# EAGLE design emonDCduo-ESP v2.4 (EAGLE 9.2.2)
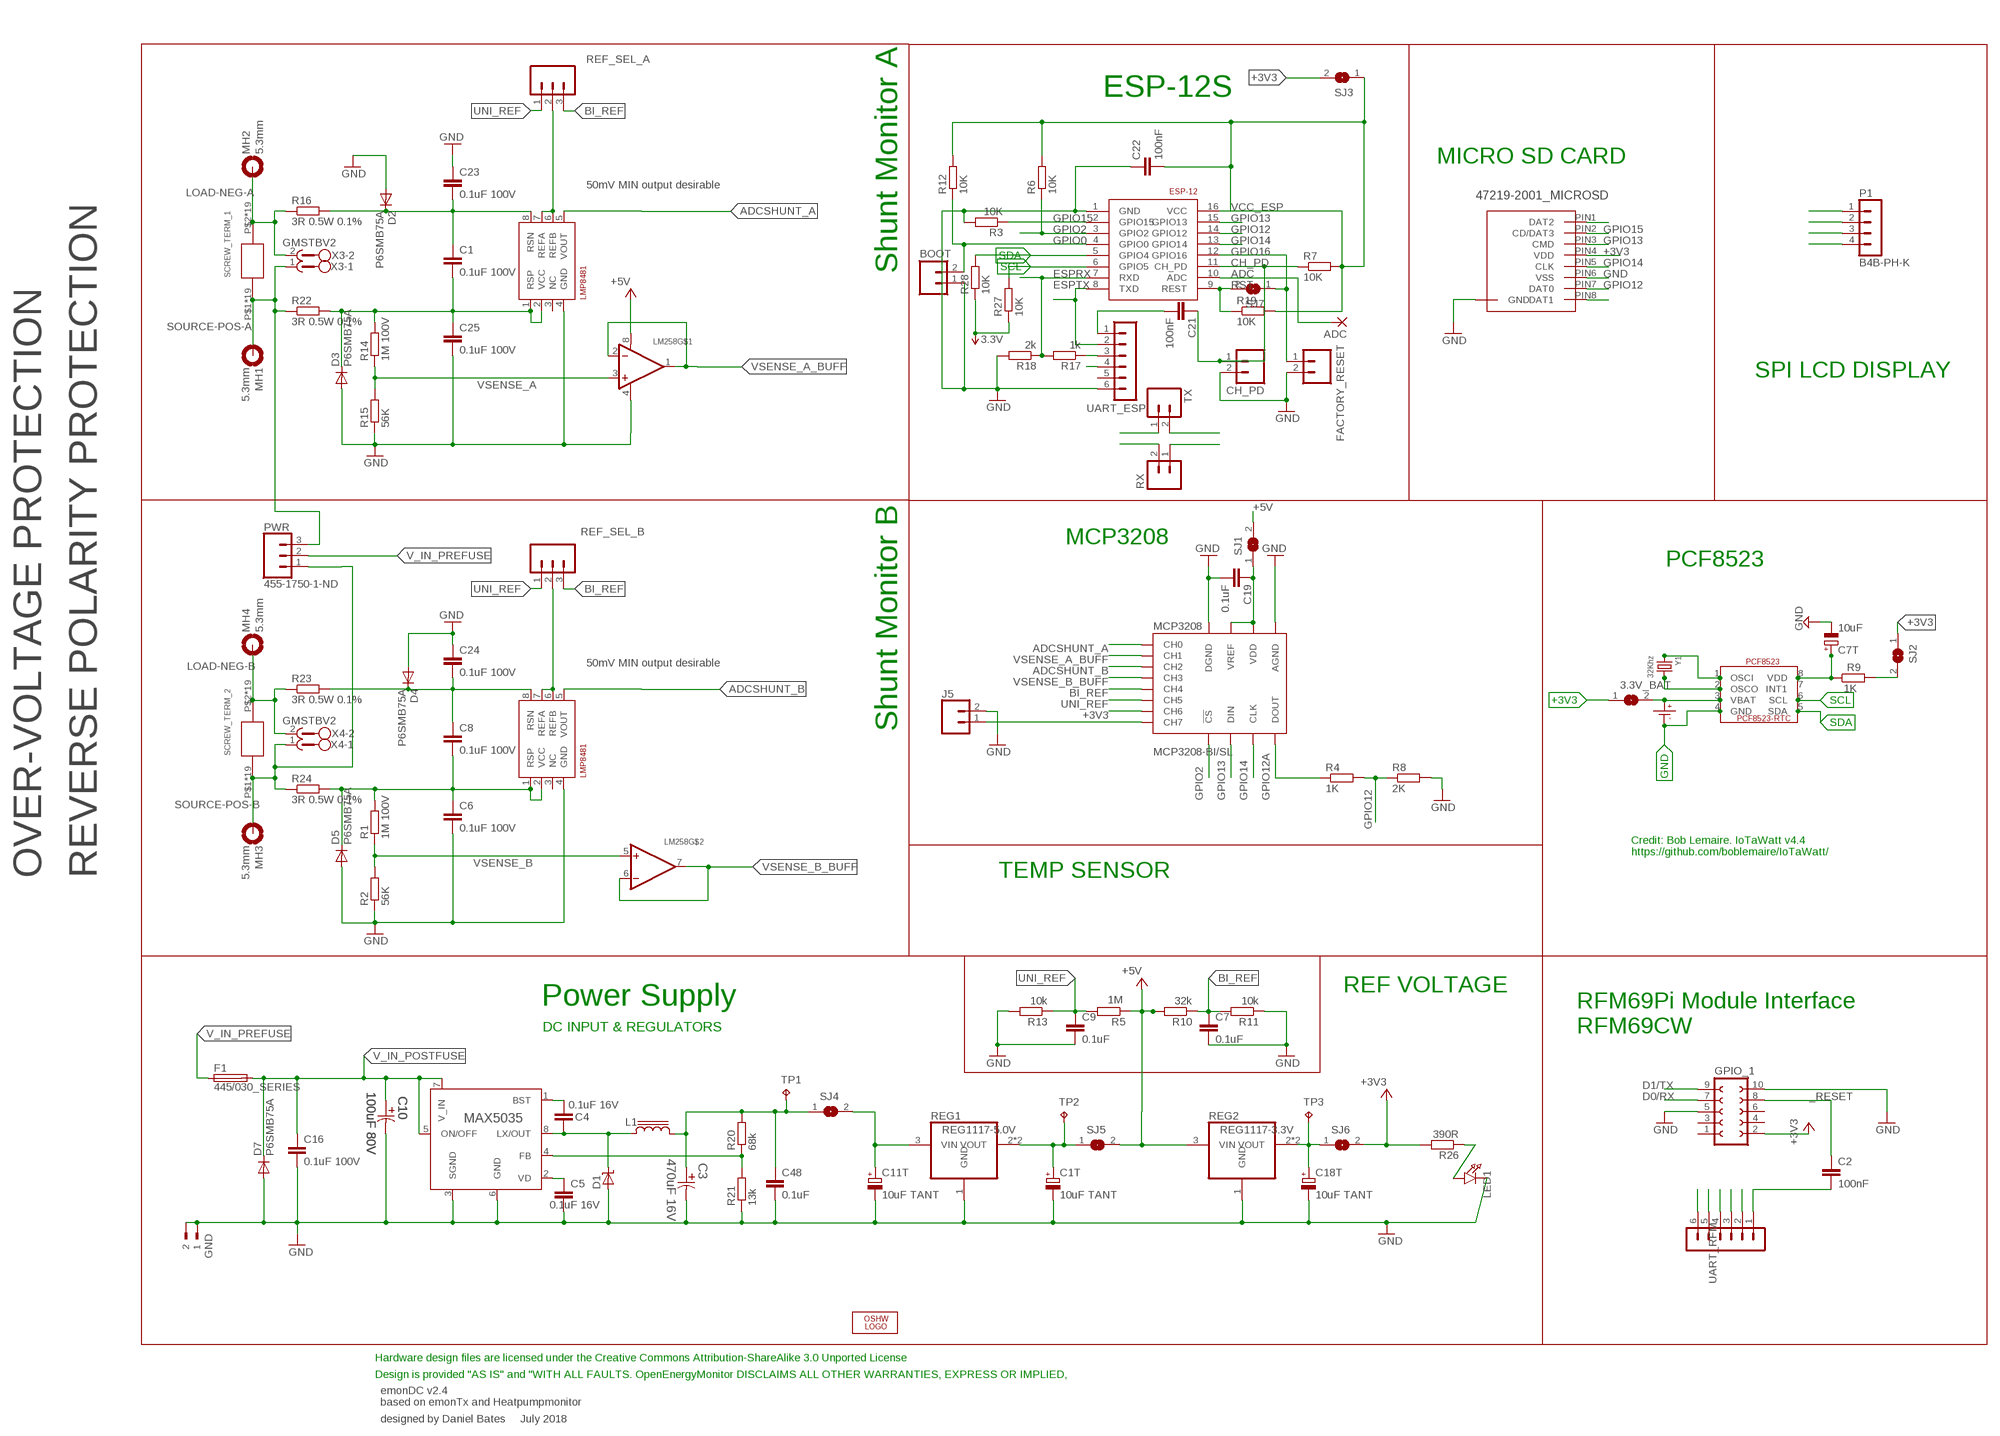
[diagram p0: schematic, sheet 1]

## Parts
3.3V_BAT  SJ-CONCON  [SJ-CON]
ADC  2,15/1,0  [2,15/1,0]
BOOT  M02PTH  [1X02]
C1  0.1uF 100V  C-EUC0603  [C0603]
C1T  10uF TANT  CPOL-EUC0603POL  [C0603POL]
C2  100nF  C-EUC0603  [C0603]
C3  470uF 16V  EEE-FK1C471P-CASE-F  [CAPAE830X1050N]
C4  0.1uF 16V  C-EUC0603  [C0603]
C5  0.1uF 16V  C-EUC0603  [C0603]
C6  0.1uF 100V  C-EUC0603  [C0603]
C7  0.1uF  C-EUC0603  [C0603]
C7T  10uF  CPOL-EUC0603POL  [C0603POL]
C8  0.1uF 100V  C-EUC0603  [C0603]
C9  0.1uF  C-EUC0603  [C0603]
C10  100uF 80V  EEV-FK1K101Q-CASE-H13  [CAPAE1350X1400N]
C11T  10uF TANT  CPOL-EUC0603POL  [C0603POL]
C16  0.1uF 100V  C-EUC0603  [C0603]
C18T  10uF TANT  CPOL-EUC0603POL  [C0603POL]
C19  0.1uF  C-EUC0603  [C0603]
C21  100nF  C-EUC0603  [C0603]
C22  100nF  C-EUC0603  [C0603]
C23  0.1uF 100V  C-EUC0603  [C0603]
C24  0.1uF 100V  C-EUC0603  [C0603]
C25  0.1uF 100V  C-EUC0603  [C0603]
C48  0.1uF  C-EUC0603  [C0603]
CH_PD  M02PTH  [1X02]
CR1220  CR1220SMD  [CR1220SMD]
D1  MBRS1100T3G  [SMB_1]
D2  P6SMB75A  DIODE-DO214AA  [DO214AA]
D3  P6SMB75A  DIODE-DO214AA  [DO214AA]
D4  P6SMB75A  DIODE-DO214AA  [DO214AA]
D5  P6SMB75A  DIODE-DO214AA  [DO214AA]
D7  P6SMB75A  DIODE-DO214AA  [DO214AA]
ESP-12  ESP8266_ESP-12  [ESP8266-ESP12]
F1  445/030_SERIES  [445/030_SERIES_LITTELFUSE]
GND  180-2  [180-2]
GPIO_1  FE05-2_RFM69PI_OUTLINERFM69PI  [FE05-2_RFM69PI_OULTINE]
IO16  FACTORY_RESET  M02PTH  [1X02]
J5  CONN_02  [1X02]
L1  SRR1208  [SSR1208]
LED1  LED1206  [CHIPLED_1206]
LM258  LM358  [SOIC8_150MIL]
LOGO1  OSHW_LOGO_6MILX0200-NT  [OSHW_6X200_NOTEXT]
MCP3208  MCP3208-BI/SL  [SOIC16]
MH1  5.3mm  MOUNT-PAD-ROUND5.3  [5,3//11-PAD]
MH2  5.3mm  MOUNT-PAD-ROUND5.3  [5,3//11-PAD]
MH3  5.3mm  MOUNT-PAD-ROUND5.3  [5,3//11-PAD]
MH4  5.3mm  MOUNT-PAD-ROUND5.3  [5,3//11-PAD]
MICRO_SD  47219-2001_MICROSD  [47219-2001_MICROSD]
P1  B4B-PH-K  [B4B-PH-K]
PCF8523  PCF8523_RTC  [SOIC_8]
PWR  455-1750-1-ND  CONN_03  [1X03]
R1  1M 100V  R-EU_R0603  [R0603]
R2  56K  R-EU_R0603  [R0603]
R3  10K  R-EU_R0603  [R0603]
R4  1K  R-EU_R0603  [R0603]
R5  1M  R-EU_R0603  [R0603]
R6  10K  R-EU_R0603  [R0603]
R7  10K  R-EU_R0603  [R0603]
R8  2K  R-EU_R0603  [R0603]
R9  1K  R-EU_R0603  [R0603]
R10  32k  R-EU_0207/10  [0207/10]
R11  10k  R-EU_0207/10  [0207/10]
R12  10K  R-EU_R0603  [R0603]
R13  10k  R-EU_R0603  [R0603]
R14  1M 100V  R-EU_R0603  [R0603]
R15  56K  R-EU_R0603  [R0603]
R16  3R 0.5W 0.1%  R-EU_R1206  [R1206]
R17  1k  R-EU_R0603  [R0603]
R18  2k  R-EU_R0603  [R0603]
R19  10K  R-EU_R0603  [R0603]
R20  68k  R-EU_R0603  [R0603]
R21  13k  R-EU_R0603  [R0603]
R22  3R 0.5W 0.1%  R-EU_R1206  [R1206]
R23  3R 0.5W 0.1%  R-EU_R1206  [R1206]
R24  3R 0.5W 0.1%  R-EU_R1206  [R1206]
R26  390R  R-EU_R0603  [R0603]
R27  10K  R-EU_R0603  [R0603]
R28  10K  R-EU_R0603  [R0603]
REF_SEL_A  455-1750-1-ND  CONN_03  [1X03]
REF_SEL_B  455-1750-1-ND  CONN_03  [1X03]
REG0  MAX5035  [21-0111D_SBE-14]
REG1  REG1117-5.0V  REG1117  [SOT223]
REG2  REG1117-3.3V  REG1117  [SOT223]
RX  M02PTH  [1X02]
SCREW_TERM_1  EBW_SERIES_15.2MM  [EBW_SERIES_15.2MM]
SCREW_TERM_2  EBW_SERIES_15.2MM  [EBW_SERIES_15.2MM]
SHUNTMON-A  LMP8481  LMP8481-H  [S-PDSO-G08]
SHUNTMON-B  LMP8481  LMP8481-H  [S-PDSO-G08]
SJ1  SJ-CONCON  [SJ-CON]
SJ2  SJ-CONCON  [SJ-CON]
SJ3  SJ-CONCON  [SJ-CON]
SJ4  SJ-CONCON  [SJ-CON]
SJ5  SJ-CONCON  [SJ-CON]
SJ6  SJ-CONCON  [SJ-CON]
SJ7  SJ  [SJ]
TP1  TPPAD1-13  [P1-13]
TP2  TPPAD1-13  [P1-13]
TP3  TPPAD1-13  [P1-13]
TX  M02PTH  [1X02]
UART_ESP  UART_ESP  MA06-1  [MA06-1]
UART_RFM  UART_RFM  MA06-1  [MA06-1]
X3  GMSTBV2  [GMSTBV2]
X4  GMSTBV2  [GMSTBV2]
Y1  32Khz  CRYSTAL8X3.8SMT  [CRYSTAL_8X3.8]

## Nets
3.3V_PRE [thin_power]: C18T.1(+) REG2.2(VOUT) REG2.4(VOUT) SJ6.1 TP3.TP
5V_PRE [thin_power]: C1T.1(+) REG1.2(VOUT) REG1.4(VOUT) SJ5.1 TP2.TP
6.5V [thin_power]: C11T.1(+) REG1.3(VIN) SJ4.2
+3V3 [thin_power]: 3.3V_BAT.1 GPIO_1.2 MCP3208.7(CH6) MICRO_SD.PIN4(VDD) P1.3 R26.2 R27.1 R28.1 SJ2.1 SJ3.2 SJ6.2 ; supply symbol labelled 3.3V
+5V [thin_power]: LM258.8(V+) R5.1 R10.2 REG2.3(VIN) SJ1.2 SJ5.2 UART_ESP.4 UART_RFM.4
_RESET: C2.1 GPIO_1.8
ADC: ADC.1(P) ESP-12.10(ADC)
ADCSHUNT_A: MCP3208.1(CH0) SHUNTMON-A.5(VOUT)
ADCSHUNT_B: MCP3208.3(CH2) SHUNTMON-B.5(VOUT)
BI_REF: C7.1 MCP3208.5(CH4) R10.1 R11.2 REF_SEL_A.3 REF_SEL_B.3
BST [thin_power]: C4.1 REG0.1(BST)
CH7: J5.1 MCP3208.8(CH7)
CH_PD: C21.1 CH_PD.1 ESP-12.11(CH_PD) R7.1
D0/RX: GPIO_1.7 TX.2 UART_RFM.2
D1/TX: GPIO_1.9 RX.1 UART_RFM.3
ESPRX: ESP-12.7(RXD) R17.2 R18.1 RX.2
ESPTX: ESP-12.8(TXD) TX.1 UART_ESP.2
GND: BOOT.1 C1T.2(-) C3.2 C5.2 C6.2 C7.2 C7T.2(-) C9.2 C10.2 C11T.2(-) C16.2 C18T.2(-) C19.2 C22.1 C23.1 C24.1 C25.2 C48.2 CH_PD.2 CR1220.P-(P$-) D1.A D2.A D3.A D4.A D5.A D7.A ESP-12.1(GND) GND.1 GND.2 GPIO_1.5 GPIO_1.10 IO16.2 J5.2 LED1.C LM258.4(V-) MCP3208.9(DGND) MCP3208.14(AGND) MICRO_SD.P$1(GND) MICRO_SD.P$2(GND) MICRO_SD.P$3(GND) MICRO_SD.P$4(GND) MICRO_SD.PIN6(VSS) P1.4 PCF8523.4(GND) R2.1 R3.2 R8.2 R11.1 R13.2 R15.1 R18.2 R21.1 REG0.3(SGND) REG0.6(GND) REG1.1(GND) REG2.1(GND) SHUNTMON-A.4(GND) SHUNTMON-B.4(GND) UART_ESP.6 UART_RFM.6
GPIO0: BOOT.2 ESP-12.4(GPIO0) R12.1
GPIO2: ESP-12.3(GPIO2) MCP3208.10(!CS) R6.1
GPIO12: ESP-12.14(GPIO12) MICRO_SD.PIN7(DAT0) R4.2 R8.1
GPIO12A: MCP3208.12(DOUT) R4.1
GPIO13: ESP-12.15(GPIO13) MCP3208.11(DIN) MICRO_SD.PIN3(CMD)
GPIO14: ESP-12.13(GPIO14) MCP3208.13(CLK) MICRO_SD.PIN5(CLK)
GPIO15: ESP-12.2(GPIO15) MICRO_SD.PIN2(CD/DAT3) R3.1
GPIO16: ESP-12.12(GPIO16) IO16.1 SJ7.1
LOAD-NEG-A [power]: MH2.B5,5(MOUNT) R16.1 SCREW_TERM_1.P$2 SCREW_TERM_1.P$18 SCREW_TERM_1.P$19 SCREW_TERM_1.P$20 SCREW_TERM_1.P$21 SCREW_TERM_1.P$22 SCREW_TERM_1.P$23 SCREW_TERM_1.P$24 SCREW_TERM_1.P$25 SCREW_TERM_1.P$26 SCREW_TERM_1.P$27 SCREW_TERM_1.P$28 SCREW_TERM_1.P$29 SCREW_TERM_1.P$30 SCREW_TERM_1.P$31 SCREW_TERM_1.P$32 SCREW_TERM_1.P$36 SCREW_TERM_1.P$37 SCREW_TERM_1.P$38 X3.2
LOAD-NEG-A_T [thin_power]: C1.1 C23.2 D2.C R16.2 SHUNTMON-A.8(RSN)
LOAD-NEG-B [power]: MH4.B5,5(MOUNT) R23.1 SCREW_TERM_2.P$2 SCREW_TERM_2.P$18 SCREW_TERM_2.P$19 SCREW_TERM_2.P$20 SCREW_TERM_2.P$21 SCREW_TERM_2.P$22 SCREW_TERM_2.P$23 SCREW_TERM_2.P$24 SCREW_TERM_2.P$25 SCREW_TERM_2.P$26 SCREW_TERM_2.P$27 SCREW_TERM_2.P$28 SCREW_TERM_2.P$29 SCREW_TERM_2.P$30 SCREW_TERM_2.P$31 SCREW_TERM_2.P$32 SCREW_TERM_2.P$36 SCREW_TERM_2.P$37 SCREW_TERM_2.P$38 X4.2
LOAD-NEG-B_T [thin_power]: C8.1 C24.2 D4.C R23.2 SHUNTMON-B.8(RSN)
LX [thin_power]: C4.2 D1.C L1.1 REG0.8(LX/OUT)
MCP_VCC: C19.1 MCP3208.15(VREF) MCP3208.16(VDD) SJ1.1
N$1: R20.1 R21.2 REG0.4(FB)
N$5: LED1.A R26.1
N$7: MICRO_SD.PIN1(DAT2)
N$10: C7T.1(+) PCF8523.8(VDD) R9.1
N$20: UART_RFM.5
N$24: R9.2 SJ2.2
N$30: C21.2 UART_ESP.1
N$32: MICRO_SD.PIN8(DAT1)
N$36: R17.1 UART_ESP.3
N$44: PCF8523.2(OSCO) Y1.P$4
N$45: PCF8523.1(OSCI) Y1.P$1
N$301: C2.2 UART_RFM.1
PRE_6.5V [thin_power]: C3.1 C48.1 L1.2 R20.2 SJ4.1 TP1.TP
REF_A_INPUT: REF_SEL_A.2 SHUNTMON-A.6(REFB) SHUNTMON-A.7(REFA)
REF_B_INPUT: REF_SEL_B.2 SHUNTMON-B.6(REFB) SHUNTMON-B.7(REFA)
RST: ESP-12.9(REST) R19.1 SJ7.2
SCL: ESP-12.6(GPIO5) P1.2 PCF8523.6(SCL) R27.2
SDA: ESP-12.5(GPIO4) P1.1 PCF8523.5(SDA) R28.2
SOURCE-POS-A [power]: MH1.B5,5(MOUNT) PWR.3 R22.1 SCREW_TERM_1.P$1 SCREW_TERM_1.P$3 SCREW_TERM_1.P$4 SCREW_TERM_1.P$5 SCREW_TERM_1.P$6 SCREW_TERM_1.P$7 SCREW_TERM_1.P$8 SCREW_TERM_1.P$9 SCREW_TERM_1.P$10 SCREW_TERM_1.P$11 SCREW_TERM_1.P$12 SCREW_TERM_1.P$13 SCREW_TERM_1.P$14 SCREW_TERM_1.P$15 SCREW_TERM_1.P$16 SCREW_TERM_1.P$17 SCREW_TERM_1.P$33 SCREW_TERM_1.P$34 SCREW_TERM_1.P$35 X3.1
SOURCE-POS-A_T [thin_power]: C1.2 C25.1 D3.C R14.2 R22.2 SHUNTMON-A.1(RSP) SHUNTMON-A.2(VCC)
SOURCE-POS-B [power]: MH3.B5,5(MOUNT) PWR.1 R24.1 SCREW_TERM_2.P$1 SCREW_TERM_2.P$3 SCREW_TERM_2.P$4 SCREW_TERM_2.P$5 SCREW_TERM_2.P$6 SCREW_TERM_2.P$7 SCREW_TERM_2.P$8 SCREW_TERM_2.P$9 SCREW_TERM_2.P$10 SCREW_TERM_2.P$11 SCREW_TERM_2.P$12 SCREW_TERM_2.P$13 SCREW_TERM_2.P$14 SCREW_TERM_2.P$15 SCREW_TERM_2.P$16 SCREW_TERM_2.P$17 SCREW_TERM_2.P$33 SCREW_TERM_2.P$34 SCREW_TERM_2.P$35 X4.1
SOURCE-POS-B_T [thin_power]: C6.1 C8.2 D5.C R1.2 R24.2 SHUNTMON-B.1(RSP) SHUNTMON-B.2(VCC)
UNI_REF: C9.1 MCP3208.6(CH5) R5.2 R13.1 REF_SEL_A.1 REF_SEL_B.1
V_IN_POSTFUSE [power]: C10.1 C16.1 D7.C F1.P$3 F1.P$4 REG0.5(ON/OFF) REG0.7(V_IN)
V_IN_PREFUSE [power]: F1.P$1 F1.P$2 PWR.2
VBAT: 3.3V_BAT.2 CR1220.P+(P$+) PCF8523.3(VBAT)
VCC_ESP: C22.2 ESP-12.16(VCC) R6.2 R7.2 R12.2 R19.2 SJ3.1
VD [thin_power]: C5.1 REG0.2(VD)
VSENSE_A: LM258.3(+IN) R14.1 R15.2
VSENSE_A_BUFF: LM258.1(OUT) LM258.2(-IN) MCP3208.2(CH1)
VSENSE_B: LM258.5(+IN) R1.1 R2.2
VSENSE_B_BUFF: LM258.6(-IN) LM258.7(OUT) MCP3208.4(CH3)
Unconnected: GPIO_1.1 GPIO_1.3 GPIO_1.4 GPIO_1.6 PCF8523.7(INT1) SHUNTMON-A.3(NC) SHUNTMON-B.3(NC) UART_ESP.5

## Notes on the sheet
- ESP-12S
- MICRO SD CARD
- 50mV MIN output desirable
- Shunt Monitor A
- SPI LCD DISPLAY
- MCP3208
- PCF8523
- 50mV MIN output desirable
- Shunt Monitor B
- Credit: Bob Lemaire. IoTaWatt v4.4
  https://github.com/boblemaire/IoTaWatt/
- OVER-VOLTAGE PROTECTION | REVERSE POLARITY PROTECTION | TEMP SENSOR
- REF VOLTAGE
- Power Supply
- DC INPUT & REGULATORS
- RFM69Pi Module Interface
  RFM69CW
- Hardware design files are licensed under the Creative Commons Attribution-ShareAlike 3.0 Unported License
- Design is provided "AS IS" and "WITH ALL FAULTS. OpenEnergyMonitor DISCLAIMS ALL OTHER WARRANTIES, EXPRESS OR IMPLIED,
- emonDC v2.4
  based on emonTx and Heatpumpmonitor
- designed by Daniel Bates     July 2018

## Library data of the parts
3.3V_BAT SJ4 = jumper-con:SJ-CON: SMD solder JUMPER
ADC = wirepad:2,15/1,0: THROUGH-HOLE PAD
BOOT CH_PD IO16 RX TX = SparkFun:M02: Header 2 Standard 2-pin 0.1" header. Use with straight break away headers (SKU : PRT-00116), right angle break away headers (PRT-00553), swiss pins (PRT-00743), machine pins (PRT-00117), and female headers (PRT-00115). Molex polarized connector foot print use with SKU : PRT-08233 with associated crimp pins and housings.
C1 C6 C8 C23-C25 = rcl:C-EU: CAPACITOR, European symbol; MPN: C1608X7S2A104K080AB
C1T C7T C11T C18T = rcl7:CPOL-EU: POLARIZED CAPACITOR, European symbol
C2 C4 C5 C7 C9 C16 C19 C21 C22 C48 = rcl:C-EU: CAPACITOR, European symbol
C3 = Panasonic-EEEFK_EEEFP:EEE-: Aluminum Electrolytic Capacitors,Surface Mount Type; MPN: EEE-FK1C471P; OC_FARNELL: 9695710; OC_NEWARK: 96K9385; PACKAGE: CASE-F; SUPPLIER: PANASONIC; TOLERANCE: ±20 %; VALUE: 470UF; VOLTAGERATING: 16V
C10 = Panasonic-EEE-EEV-EEF-ECQ:EEV-: Aluminum Electrolytic Capacitors,Surface Mount Type; MPN: EEVFK1K101Q; OC_FARNELL: 9696113; OC_NEWARK: 96K9484; SUPPLIER: PANASONIC; TOLERANCE: ±20 %; VALUE: 100UF; VOLTAGERATING: 80V
CR1220 = IotaWatt_parts:CR1220SMD: CR1220 Battery SMD; MPN: Harwin S8411-45R
D1 = diodes:MBRS1100T3G: MBRS1100T3G 100V 1A Freewheeling Diode; MPN: MBRS1100T3G
D2-D5 D7 = diode:DIODE-: DIODE
ESP-12 = ESP8266-ESP12:ESP8266_ESP-12
F1 = LITTELFUSE 455:030 SERIES:445/030_SERIES: MPN 04450001N
GND = con-weidmueller-sl35_db:180-2: WEIDMUELLER CLAMP CONNECTOR; OC_FARNELL: unknown; OC_NEWARK: unknown
GPIO_1 = con-lsta-RFM69Pi:FE05-2_RFM69PI_OUTLINE: FEMALE HEADER
J5 = SparkFun-Connectors:CONN_02: Multi connection point. Often used as Generic Header-pin footprint for 0.1 inch spaced/style header connections On any of the 0.1 inch spaced packages, you can populate with these: Break Away Headers - Straight <https://www.sparkfun.com/products/116> (PRT-00116) Break Away Male Headers - Right Angle <https://www.sparkfun.com/products/553> (PRT-00553) Female Headers <https://www.sparkfun.com/products/115> (PRT-00115) Break Away Headers - Machine Pin <https://www.sparkfun.com/products/117> (PRT-00117) Break Away Female Headers - Swiss Machine Pin <https://www.sparkfun.com/products/743> (PRT-00743) For SCREWTERMINALS and SPRING TERMINALS visit here: Screw Terimnals on SparkFun.com <https://www.sparkfun.com/search/results?term=Screw+Terminals> (5mm/3.5mm/2.54mm spacing) This device is also useful as a general connection point to wire up your design to another part of your project. Our various solder wires solder well into these plated through hole pads. Hook-Up Wire - Assortment (Stranded, 22 AWG) <https://www.sparkfun.com/products/11375> (PRT-11375) Hook-Up Wire - Assortment (Solid Core, 22 AWG) <https://www.sparkfun.com/products/11367> (PRT-11367) View the entire wire category on our website here <https://www.sparkfun.com/categories/141> Special notes: Molex polarized connector foot print use with: PRT-08233 with associated crimp pins and housings. 2.54_SCREWTERM for use with PRT-10571. 3.5mm Screw Terminal footprints for PRT-08084 5mm Screw Terminal footprints for use with PRT-08432
L1 = inductor-bourns:SRR1208: POWER INDUCTOR; MPN: SRR1208-151YL
LED1 = microbuilder:LED: LED 0603 - 0603 Surface Mount Package 2mA: Green LED - Low Power (3.9mcd, 2ma, 1.7Vf) - Digikey: 475-2709-2-ND Orange LED - Low Power (9.8mcd, 2ma, 1.8Vf) - Digikey: 475-1194-2-ND Red LED - Low Power (5mcd, 2ma, 1.8Vf) - Digikey: 475-1195-2-ND Yellow LED - Low Power (7mcd, 2ma, 1.8Vf) - Digikey: 475-1196-2-ND 5mA: Blue LED - Low Power (17mcd, 5ma, 2.9Vf) - Digikey: LNJ937W8CRACT-ND 0805 - 0805 Surface Mount Package 2mA: Red LED (8.8mcd, 2mA, 1.8Vf, Clear) - Low Power [Digikey: 475-2510-1-ND] Green LED (5mcd, 2mA, 1.8Vf, Clear) - Low Power [Digikey: 475-2730-1-ND] Yellow LED (11.3mcd, 2mA, 1.8Vf, Clear) - Low Power [Digikey: 475-2555-1-ND] 20mA: Red LED (104mcd, 20mA, Diffused) - LS R976 [Digikey: 475-1278-6-ND] Red LED (12mcd, 20mA, 2.0Vf, Clear) - APT2012EC [Digikey: 754-1128-1-ND] Green LED (15mcd, 20mA, 2.2Vf, Clear) - APT2012GC [Digikey: 754-1131-1-ND] Orange LED (160mcd, 20mA, 2.1Vf, Clear) - APT2012SECK [Digikey: 754-1130-1-ND] 1206 - 1206 Surface Mount Package Green LED (26mcd, 20mA, Diffused) - LG N971 [Digikey: 475-1407-6-ND] Red LED (15mcd, 20mA, Diffused) - LH N974 [Digikey: 475-1416-6-ND]
LM258 = microbuilder:LM358: LM358 Dual Operational Amplifier Digikey: LM358AMXFSCT-ND
LOGO1 = ohw-logo:OSHW_LOGO_6MIL; OC_FARNELL: unknown
MCP3208 = MCP3208:MCP3208
MH1-MH4 = holes-db:MOUNT-PAD-ROUND: MOUNTING PAD, round
MICRO_SD = MOLEX 47219-2001:47219-2001_MICROSD
P1 = JST-PH:B4B-PH-K: HEADER
PCF8523 = emonDC parts:PCF8523_RTC: PCF8523-RTC SOIC-8
PWR = SparkFun-Connectors:CONN_03: Multi connection point. Often used as Generic Header-pin footprint for 0.1 inch spaced/style header connections On any of the 0.1 inch spaced packages, you can populate with these: Break Away Headers - Straight <https://www.sparkfun.com/products/116> (PRT-00116) Break Away Male Headers - Right Angle <https://www.sparkfun.com/products/553> (PRT-00553) Female Headers <https://www.sparkfun.com/products/115> (PRT-00115) Break Away Headers - Machine Pin <https://www.sparkfun.com/products/117> (PRT-00117) Break Away Female Headers - Swiss Machine Pin <https://www.sparkfun.com/products/743> (PRT-00743) Stackable Header - 3 Pin (Female, 0.1") <https://www.sparkfun.com/products/13875> (PRT-13875) For SCREWTERMINALS and SPRING TERMINALS visit here: Screw Terimnals on SparkFun.com <https://www.sparkfun.com/search/results?term=Screw+Terminals> (5mm/3.5mm/2.54mm spacing) This device is also useful as a general connection point to wire up your design to another part of your project. Our various solder wires solder well into these plated through hole pads. Hook-Up Wire - Assortment (Stranded, 22 AWG) <https://www.sparkfun.com/products/11375> (PRT-11375) Hook-Up Wire - Assortment (Solid Core, 22 AWG) <https://www.sparkfun.com/products/11367> (PRT-11367) View the entire wire category on our website here <https://www.sparkfun.com/categories/141> Special notes: Molex polarized connector foot print use with SKU : PRT-08232 with associated crimp pins and housings.; PROD_ID: XXX-00000
R1 R14 = rcl:R-EU_: RESISTOR, European symbol; MPN: MCWR06X1003FTL
R2 R4 R8 R15 = rcl:R-EU_: RESISTOR, European symbol; MPN: MCWR06X5901FTL
R3 R6 R7 R12 R17-R19 R27 R28 = rcl:R-EU_: RESISTOR, European symbol
R5 R10 R11 R13 R16 R22-R24 = rcl7:R-EU_: RESISTOR, European symbol
R9 R20 R21 = rcl@1:R-EU_: RESISTOR, European symbol
R26 = rcl:R-EU_: RESISTOR, European symbol; SPICEPREFIX: R
REF_SEL_A REF_SEL_B = SparkFun-Connectors:CONN_03: Multi connection point. Often used as Generic Header-pin footprint for 0.1 inch spaced/style header connections On any of the 0.1 inch spaced packages, you can populate with these: Break Away Headers - Straight <https://www.sparkfun.com/products/116> (PRT-00116) Break Away Male Headers - Right Angle <https://www.sparkfun.com/products/553> (PRT-00553) Female Headers <https://www.sparkfun.com/products/115> (PRT-00115) Break Away Headers - Machine Pin <https://www.sparkfun.com/products/117> (PRT-00117) Break Away Female Headers - Swiss Machine Pin <https://www.sparkfun.com/products/743> (PRT-00743) Stackable Header - 3 Pin (Female, 0.1") <https://www.sparkfun.com/products/13875> (PRT-13875) For SCREWTERMINALS and SPRING TERMINALS visit here: Screw Terimnals on SparkFun.com <https://www.sparkfun.com/search/results?term=Screw+Terminals> (5mm/3.5mm/2.54mm spacing) This device is also useful as a general connection point to wire up your design to another part of your project. Our various solder wires solder well into these plated through hole pads. Hook-Up Wire - Assortment (Stranded, 22 AWG) <https://www.sparkfun.com/products/11375> (PRT-11375) Hook-Up Wire - Assortment (Solid Core, 22 AWG) <https://www.sparkfun.com/products/11367> (PRT-11367) View the entire wire category on our website here <https://www.sparkfun.com/categories/141> Special notes: Molex polarized connector foot print use with SKU : PRT-08232 with associated crimp pins and housings.; MF: MULTICOMP; MPN: 2212S-02SG-85; OC_FARNELL: 1593458; PROD_ID: XXX-00000
REG0 = MAX5035:MAX5035: SWITCHING REGULATOR 5.0V 1.0A; MPN: MAX5035EASA+
REG1 = burr-brown-db:REG1117: 800mA and 1A Low Dropout (LDO) Positive Regulator 1.8V, 2.5V, 2.85V, 3.3V, 5V, and Adj; MF: TEXAS INSTRUMENTS; MPN: REG1117-5.0; OC_FARNELL: 1097566; OC_NEWARK: 14P6981
REG2 = burr-brown-db:REG1117: 800mA and 1A Low Dropout (LDO) Positive Regulator 1.8V, 2.5V, 2.85V, 3.3V, 5V, and Adj; MF: TEXAS INSTRUMENTS; MPN: REG1117-3.3; OC_FARNELL: 1097566; OC_NEWARK: 14P6981
SCREW_TERM_1 SCREW_TERM_2 = EBW series SHUNT:EBW_SERIES_15.2MM
SHUNTMON-A = lmp8481b:LMP8481: LMP8481MM-H/NOPB 100V/V; MF: TEXAS INSTRUMENTS; MPN: LMP8481MME-S/NOPB; OC_FARNELL: 2322044
SHUNTMON-B = lmp8481b:LMP8481: LMP8481MM-H/NOPB 100V/V; MF: TEXAS INSTRUMENTS; MPN: LMP8481MME-H/NOPB; OC_FARNELL: 2322044
SJ1-SJ3 SJ5 SJ6 = jumper-con_db:SJ-CON: SMD solder JUMPER
SJ7 = jumper:SJ: SMD solder JUMPER
TP1-TP3 = testpad:TP: Test pad
UART_ESP UART_RFM = JeeLabs:MA06-1: PIN HEADER
X3 X4 = con-phoenix-762:GMSTBV2: PHOENIX; MPN: GMSTBVA2,5/2-G-7,62; OC_FARNELL: 1793079; OC_NEWARK: 69R9520
Y1 = microbuilder:CRYSTAL: Crystals HC49UP - Surface Mount Crystal 4.0MHz 18pF +/-30ppm Surface Mount Crystal [Digikey: 535-9857-1-ND] 12.0 MHz Surface Mount Crystal [Digikey: 535-9869-6-ND] 25.0 MHz Surface Mount Crystal [Digikey: 535-9078-1-ND] 2.5 x 2.0mm - MEMs SMT Crystal 16.0 MHz 10pF 20ppm 2.5 x 2.0mm Crystal [Digikey -40-85°C: 535-10923-1-ND] 3.2 x 2.5mm - MEMs SMT Crystal 12.0 MHz 8pF 15ppm 3.2 x 2.5mm Crystal [Digikey: -10-70°C: 644-1047-1-ND -40-125°C: 644-1128-1-ND] 16.0 MHz 8pF 15ppm 3.2 x 2.5mm Crystal [Digikey: -10-70°C: 644-1049-1-ND -40-125°C: 644-1129-2-ND] 16.0 MHz 10pF 10ppm 3.2 x 2.5mm Crystal [Digikey: 644-1100-1-ND] 27.12 MHz 18pF 30ppm 3.2 x 2.5mm Crystal [Digikey: 887-1424-1-ND] 27.12MHz 10pF 10ppm 3.2 x 2.5mm Crystal [Digikey: 887-1329-1-ND] 4.9 x 1.8mm - MEMs SMT Crystal 32.768 KHz 12.5pF 20ppm 4.9 x 1.8mm Crystal [Digikey: SE2415CT-ND] 8.0 x 3.8mm - Surface Mount Crystal 32.768kHz 12.5pF 20ppm -40°C-85°C [Digikey: 535-9166-2-ND] Cylinder 32.768KHz Cylinder Crystal (2x6mm body) [Ex. Digikey: 300-8341-2-ND]

## Net classes
0 default: clearance 0.203 mm
1 power: width 0.61 mm, clearance 0.61 mm
2 thin_power: width 0.406 mm, clearance 0.305 mm

## Board
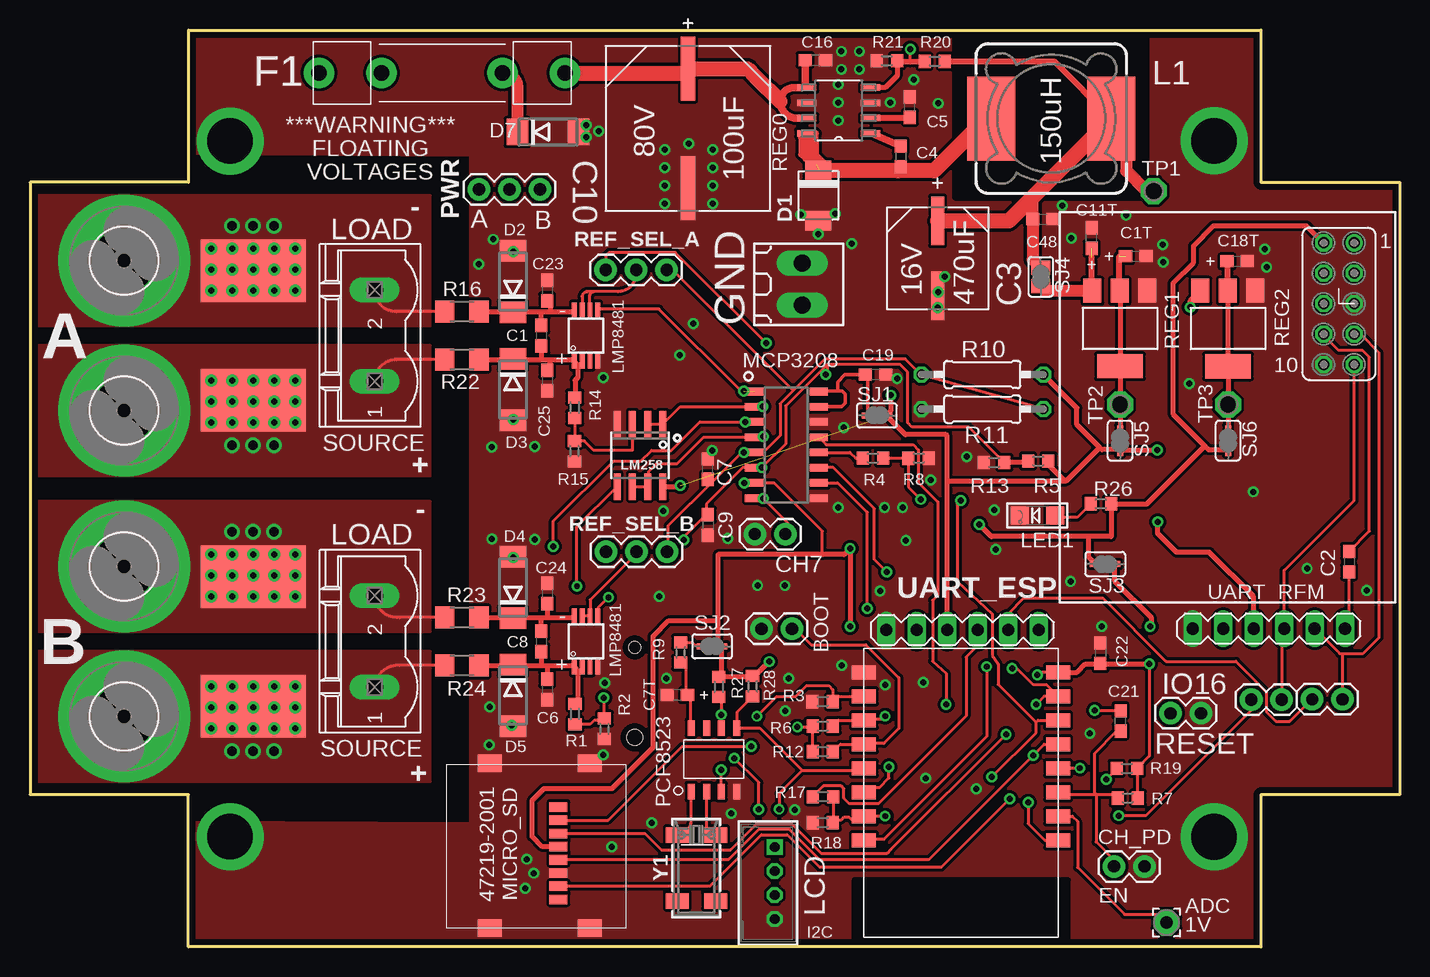
[diagram p1: board, top side]
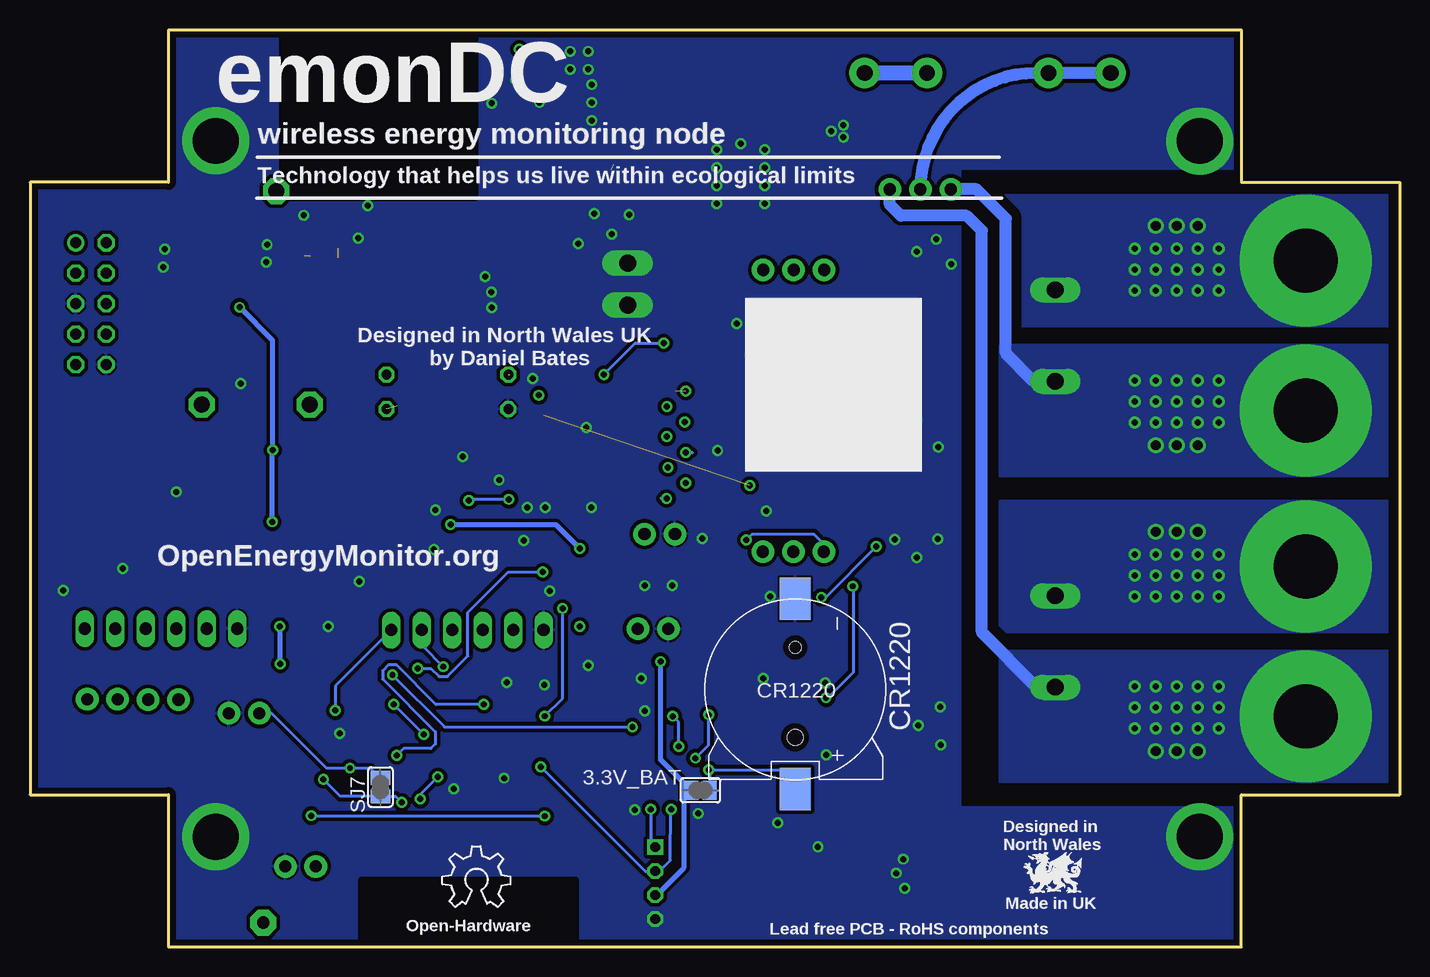
[diagram p2: board, bottom side, seen from below]

Size 114.15 x 76.45 mm. Coordinates in mm from the lower left corner, seen from the top.
Outline: 13.2,76.45 13.2,63.75 0,63.75 0,12.7 13.2,12.7 13.2,0 102.6,0 102.6,12.7 114.15,12.7 114.15,63.75 102.6,63.75 102.6,76.45 13.2,76.45
Copper layers (1*16): Top 0.035mm / dielectric 1.5mm / Bottom 0.035mm
Design rules "defaultDB *": minimum track width 10mil, minimum drill 19mil, track to track 8mil, track to pad 8mil, pad to pad 8mil, via to via 10mil, smd to smd 8mil, copper to edge 20mil, drill to drill 10mil, minimum pad ring 10mil, minimum via ring 8mil, stop-mask expansion 4mil, vias tented up to drill 0mil, thermal gap 7mil
tRestrict: area 68.7,0.2 to 86.5,5.6; area 77.1,62.5 to 93.1,76.2
bRestrict: area 68.7,0.2 to 86.5,5.6; area 77.1,62.5 to 93.1,76.2

### Footprints (pad centres in the part's own frame; a part is rotated, then mirrored left to right if it is on the bottom)
SJ-CON = smd 1.168 x 1.6: 1 -0.762,0; 2 0.762,0
2,15/1,0 = drill 1.016 pad 2.159 octagon: 1 0,0
1X02 = drill 1.016 pad 1.88: 1 0,0; 2 2.54,0
C0603 = smd 1.1 x 1: 1 -0.85,0; 2 0.85,0
C0603POL = smd 1.1 x 1: 1 -0.85,0; 2 0.85,0
CAPAE830X1050N = smd 4.064 x 1.092: 1 -3.124,0; 2 3.124,0
CAPAE1350X1400N = smd 5.359 x 1.194: 1 -4.978,0; 2 4.978,0
CR1220SMD = smd 3.54 x 2.6: P+ 8.3,0; P- -7.55,0 | hole 1: -3.5,0 | hole 1.3: 4,0
SMB_1 = smd 1.62 x 2.18: A 2.11,0; C -2.11,0
DO214AA = smd 1.8 x 2.2: A 2.55,0; C -2.55,0
ESP8266-ESP12 = smd 2 x 1.2: 1 16.2,2; 2 16.2,4; 3 16.2,6; 4 16.2,8; 5 16.2,10; 6 16.2,12; 7 16.2,14; 8 16.2,16; 9 0,16; 10 0,14; 11 0,12; 12 0,10; 13 0,8; 14 0,6; 15 0,4; 16 0,2
445/030_SERIES_LITTELFUSE = drill 1.3 pad 2.54: P$1 -10.25,0; P$2 -5.05,0; P$3 10.25,0; P$4 5.05,0
180-2 = drill 1.422 long: 1 -1.75,0; 2 1.75,0
FE05-2_RFM69PI_OULTINE = drill 0.914: 1 24.511,29.972 | drill 0.914 octagon: 2 21.971,29.972; 3 24.511,27.432; 4 21.971,27.432; 5 24.511,24.892; 6 21.971,24.892; 7 24.511,22.352; 8 21.971,22.352; 9 24.511,19.812; 10 21.971,19.812
SSR1208 = smd 7 x 4: 1 0,5; 2 0,-5
CHIPLED_1206 = smd 1.5 x 1.5: A 0,-1.496; C 0,1.496
SOIC8_150MIL = smd 0.6 x 2.2: 1 -1.905,-2.6; 2 -0.635,-2.6; 3 0.635,-2.6; 4 1.905,-2.6; 5 1.905,2.6; 6 0.635,2.6; 7 -0.635,2.6; 8 -1.905,2.6
SOIC16 = smd 0.635 x 1.524: 1 -4.445,-2.695; 2 -3.175,-2.695; 3 -1.905,-2.695; 4 -0.635,-2.695; 5 0.635,-2.695; 6 1.905,-2.695; 7 3.175,-2.695; 8 4.445,-2.695; 9 4.445,2.695; 10 3.175,2.695; 11 1.905,2.695; 12 0.635,2.695; 13 -0.635,2.695; 14 -1.905,2.695; 15 -3.175,2.695; 16 -4.445,2.695
5,3//11-PAD = drill 5.3 pad 11: B5,5 0,0
47219-2001_MICROSD = smd 1.45 x 2: P$1 0,0; P$2 13.75,0; P$3 0,8.3; P$4 13.75,8.3 | smd 0.8 x 1.5: PIN1 10.08,2.6; PIN2 8.98,2.6; PIN3 7.88,2.6; PIN4 6.78,2.6; PIN5 5.68,2.6; PIN6 4.58,2.6; PIN7 3.48,2.6; PIN8 2.38,2.6
B4B-PH-K = drill 0.813 square: 1 -3,0 | drill 0.813 octagon: 2 -1,0; 3 1,0; 4 3,0
SOIC_8 = smd 1.3 x 0.6: 1 -2.6,1.9; 2 -2.6,0.6; 3 -2.6,-0.6; 4 -2.6,-1.9; 5 2.7,-1.9; 6 2.7,-0.6; 7 2.7,0.6; 8 2.7,1.9
1X03 = drill 1.016 pad 1.88: 1 0,0; 2 2.54,0; 3 5.08,0
R0603 = smd 1 x 1.1: 1 -0.85,0; 2 0.85,0
0207/10 = drill 0.813 octagon: 1 -5.08,0; 2 5.08,0
R1206 = smd 1.6 x 1.803: 1 -1.422,0; 2 1.422,0
21-0111D_SBE-14 = smd 1.6 x 0.533: 1 -2.654,1.905; 2 -2.654,0.635; 3 -2.654,-0.635; 4 -2.654,-1.905; 5 2.654,-1.905; 6 2.654,-0.635; 7 2.654,0.635; 8 2.654,1.905
SOT223 = smd 1.499 x 2.007: 1 -2.261,-3.15; 2 0.025,-3.15; 3 2.311,-3.15 | smd 3.81 x 2.007: 4 0,3.15
EBW_SERIES_15.2MM = smd 5.2 x 8.75: P$1 -5.4,0; P$2 5.4,0 | drill 0.5: P$3 -3.75,3.5; P$4 -3.75,1.75; P$5 -3.75,0; P$6 -3.75,-1.75; P$7 -3.75,-3.5; P$8 -5.5,3.5; P$9 -5.5,1.75; P$10 -5.5,0; P$11 -5.5,-1.75; P$12 -5.5,-3.5; P$13 -7.25,3.5; P$14 -7.25,1.75; P$15 -7.25,0; P$16 -7.25,-1.75; P$17 -7.25,-3.5; P$18 7.25,1.75; P$19 7.25,3.5; P$20 7.25,0; P$21 7.25,-1.75; P$22 7.25,-3.5; P$23 5.5,3.5; P$24 5.5,1.75; P$25 5.5,0; P$26 5.5,-1.75; P$27 5.5,-3.5; P$28 3.75,3.5; P$29 3.75,1.75; P$30 3.75,0; P$31 3.75,-1.75; P$32 3.75,-3.5 | drill 0.8: P$33 -9.155,1.75; P$34 -9.155,0; P$35 -9.155,-1.75; P$36 9.155,1.75; P$37 9.155,0; P$38 9.155,-1.75
S-PDSO-G08 = smd 0.4 x 1.2: 1 -0.975,-2.157; 2 -0.325,-2.157; 3 0.325,-2.157; 4 0.975,-2.157; 5 0.975,2.157; 6 0.325,2.157; 7 -0.325,2.157; 8 -0.975,2.157
SJ-CON' = smd 1.016 x 0.508: 1 -0.762,0; 2 0.762,0
SJ = smd 1.168 x 1.6: 1 -0.762,0; 2 0.762,0
P1-13 = drill 1.321 pad 2.159 octagon: TP 0,0
MA06-1 = drill 1.016 long: 1 0,0; 2 2.54,0; 3 5.08,0; 4 7.62,0; 5 10.16,0; 6 12.7,0
GMSTBV2 = drill 1.397 long: 1 -3.81,0; 2 3.81,0
CRYSTAL_8X3.8 = smd 1.3 x 1.9: P$1 -2.75,-1.6; P$2 2.75,-1.6; P$3 2.75,1.6; P$4 -2.75,1.6

### Placement (x,y rotation side)
3.3V_BAT  58.29,13.07 0 bottom
ADC  94.71,2.03 0 top
BOOT  60.96,26.53 0 top
C1  42.61,50.97 270 top
C1T  92.14,57.59 0 top
C2  109.92,32.13 270 top
C3  75.64,57.41 270 top
C4  72.55,65.92 270 top
C5  73.32,70.01 90 top
C6  43.09,21.47 270 top
C7  56.48,39.84 90 top
C7T  53.95,21.01 180 top
C8  42.61,25.47 270 top
C9  56.49,35.18 270 top
C10  54.83,68.24 270 top
C11T  88.47,59.1 90 top
C16  65.44,73.94 0 top
C18T  100.6,57.18 0 top
C19  70.47,47.74 0 top
C21  90.89,18.84 90 top
C22  89.21,24.49 270 top
C23  43.09,54.72 270 top
C24  43.09,29.47 270 top
C25  43.09,47.22 270 top
C48  84.4,60.68 0 top
CH_PD  90.34,6.72 0 top
CR1220  50.39,21.47 270 bottom
D1  65.69,62.65 270 top
D2  40.24,55.47 90 top
D3  40.24,46.47 270 top
D4  40.24,29.97 90 top
D5  40.24,20.97 270 top
D7  43.17,67.94 0 top
ESP-12  85.68,24.89 180 top
F1  34.34,72.87 0 top
GND  64.36,55.26 270 top
GPIO_1  85.83,28.73 0 top
IO16  95.04,19.49 0 top
J5  62.94,34.43 180 top
L1  85.11,69.06 90 top
LED1  83.96,35.97 90 top
LM258  50.83,40.98 180 top
LOGO1  79.79,3.32 0 bottom
MCP3208  63.03,41.87 270 top
MH1  7.84,44.72 0 top
MH2  7.84,57.22 0 top
MH3  7.84,19.22 0 top
MH4  7.84,31.72 0 top
MICRO_SD  46.63,1.59 90 top
P1  62.06,5.33 270 top
PCF8523  57,15.56 90 top
PWR  42.5,63.17 180 top
R1  45.41,19.42 90 top
R2  47.86,18.19 90 top
R3  66.05,20.46 180 top
R4  70.24,40.76 0 top
R5  84.02,40.51 180 top
R6  66.06,18.41 180 top
R7  91.48,12.42 0 top
R8  74.06,40.75 0 top
R9  54.22,24.56 90 top
R10  79.37,47.73 0 top
R11  79.37,44.84 0 top
R12  66.07,16.28 180 top
R13  80.34,40.39 180 top
R14  45.39,44.97 90 top
R15  45.37,41.34 90 top
R16  35.99,52.97 0 top
R17  66.08,12.53 0 top
R18  66.06,10.37 180 top
R19  91.4,14.89 0 top
R20  75.39,73.83 0 top
R21  71.4,73.88 0 top
R22  35.99,48.97 0 top
R23  35.99,27.47 0 top
R24  35.99,23.47 0 top
R26  89.24,36.95 0 top
R27  57.4,21.69 270 top
R28  60.21,21.74 270 top
REF_SEL_A  47.97,56.46 0 top
REF_SEL_B  48,32.95 0 top
REG0  67.39,69.74 180 top
REG1  90.84,51.57 180 top
REG2  99.84,51.56 180 top
RX  104.31,20.62 180 top
SCREW_TERM_1  18.59,50.97 90 top
SCREW_TERM_2  18.59,25.47 90 top
SHUNTMON-A  46.34,50.97 0 top
SHUNTMON-B  46.34,25.47 0 top
SJ1  [SJ-CON']  70.58,44.32 0 top
SJ2  [SJ-CON']  56.85,25.06 180 top
SJ3  [SJ-CON']  89.6,31.92 180 top
SJ4  84.23,55.87 270 top
SJ5  [SJ-CON']  90.84,42.22 270 top
SJ6  [SJ-CON']  99.84,42.22 270 top
SJ7  84.95,13.33 270 bottom
TP1  93.63,63.03 0 top
TP2  90.84,45.22 0 top
TP3  99.84,45.22 0 top
TX  106.84,20.65 0 top
U$1  [DRAGON_LOGO_NOTEXT]  28.75,6.15 0 bottom
U$2  [ALIGNMENT_STOP]  21.34,9.22 0 top
U$3  [ALIGNMENT_STOP]  94.34,67.22 0 top
UART_ESP  84.05,26.42 180 top
UART_RFM  109.59,26.54 180 top
X3  28.72,50.97 90 top
X4  28.72,25.47 90 top
Y1  55.54,6.59 270 top

### Tracks (layer width: path | path; a pad name or v marks a point on that pad's centre or on a via)
3.3V_PRE
  Top 0.406: REG2.2 99.81,48.44 REG2.4 TP3.TP SJ6.1 | 99.81,57.11 C18T.1
  Top 0.508: REG2.2 99.81,57.11
5V_PRE  (1 unrouted)
  Top 0.406: REG1.2 90.84,54.69 REG1.4 TP2.TP SJ5.1
  Top 0.508: REG1.2 90.78,54.75 90.78,57.59
6.5V  (1 unrouted)
  Top 0.508: REG1.3 88.47,54.77 88.47,57.49
  Top 1.016: SJ4.2 84.62,54.72 REG1.3
+3V3  (via drill 0.5)
  Top 0.254: 66.03,32.72 66.03,34.67 62.01,38.69 MCP3208.7 arc-90 60.26,38.61 59.59,38.61 v59.52,38.68
  Top 0.406: GPIO_1.2 106.37,60.13 98.64,60.13 96.96,58.45 96.96,57.06 95.23,55.33 95.23,44.45 97.9,41.78 | 97.9,41.78 98.21,41.47 SJ6.2 | 97.9,41.78 93.07,36.95 R26.2 90.09,34.21 88.19,34.21 | 88.19,34.21 88.19,32.57 SJ3.2 | 88.19,34.21 80.12,34.21 v79.11,35.22 | v68.34,26.72 v68.34,33.22 67.84,32.72 66.03,32.72 57.34,32.72 57.34,27.22 | 57.34,27.22 57.34,25.33 SJ2.1 57.61,22.75 R27.1 60.16,22.54 R28.1 60.41,22.59 v61.61,23.79 | MICRO_SD.PIN4 42.69,8.37 41.84,9.22 41.84,12.22 42.84,13.22 48.52,13.22 51.93,16.63 51.93,25.91 53.24,27.22 57.34,27.22
  Bottom 0.406: v79.11,35.22 70.34,35.22 v68.34,33.22 | v61.61,23.79 61.61,15.59 61.57,15.59 59.59,13.61 | 59.59,13.61 59.65,13.54 59.65,6.6 61.93,4.33 P1.3 | 3.3V_BAT.1 59.59,13.61
+5V  (via drill 0.5)  (1 unrouted)
  Top 0.406: v93.93,41.45 90.85,41.45 SJ5.2 89.34,41.46 89.14,41.66 | v96.69,53.33 96.69,53.88 REG2.3 | v93.96,35.45 93.96,34.48 95.55,32.89 98.29,32.89 101.97,29.21 UART_RFM.4 | 89.14,41.66 87.24,43.56 87.24,44.94 R10.2 | v71.75,46 71.75,44.73 SJ1.2 72.94,42.72 76.34,42.72 76.43,42.63 76.43,38.86 | UART_ESP.4 76.43,38.86 | v54.18,38.48 54.08,38.38 LM258.8 | 76.43,38.86 86.22,38.86 | 86.22,38.86 86.35,38.86 89.14,41.66 | R5.1 84.87,40.21 86.22,38.86
  Bottom 0.406: v93.96,35.45 93.96,41.41 v93.93,41.45 93.93,50.57 v96.69,53.33
_RESET
  Top 0.254: 109.97,33.03 C2.1 111.61,34.67 111.61,49.18 111.05,49.75 109.05,49.75 107.8,51 GPIO_1.8
ADC
  Top 0.254: ESP-12.10 86.87,10.89 87.3,10.46 87.3,6.64 91.22,2.72 94.02,2.72 ADC.1
ADCSHUNT_A  (via drill 0.5)  (1 unrouted)
  Top 0.254: SHUNTMON-A.5 47.37,53.2 52.4,53.2 59.15,46.46 59.37,46.46 59.49,46.34 v59.49,46.35
  Bottom 0.254: 59.26,46.35 v59.49,46.35
ADCSHUNT_B  (via drill 0.48, 0.5)
  Top 0.254: v48.2,29.15 47.31,28.26 SHUNTMON-B.5 | v43.62,33.38 43.62,35.5 48.63,40.51 50.91,40.51 51.8,41.4 53.45,41.4 55.83,43.78 v59.59,43.78 v59.59,43.77 MCP3208.3
  Bottom 0.254: v43.62,33.38 47.84,29.15 v48.2,29.15
BI_REF  (via drill 0.5)  (2 unrouted)
  Top 0.254: 83.56,45.1 74.18,47.73 | 60.33,41.23 60.29,41.2 61.08,41.2 62.51,42.63 62.51,45.29 63.6,46.37 | 60.33,41.23 MCP3208.5 60.4,41.2 | 63.6,46.37 66.25,49.02 72.95,49.02 74.29,47.69 R10.1 | REF_SEL_B.3 53.16,33.03 53.16,35.09 56.97,38.9 | 63.6,46.37 53.51,56.46 REF_SEL_A.3 | 56.97,38.9 59.29,41.23 v59.49,41.23 60.33,41.23 | C7.1 56.58,38.9 56.97,38.9
  Bottom 0.254: 58.95,41.23 v59.49,41.23
BST
  Top 0.254: 70.12,67.83 REG0.1
  Top 0.61: C4.1 70.12,67.83
CH7  (via drill 0.5)
  Top 0.254: v61.11,37.4 63.49,35.02 63.49,34.59 J5.1 | v61.11,37.4 61.08,37.43 60.4,37.43 MCP3208.8 60.36,37.4 v61.11,37.4
  Bottom 0.254: 61.56,37.4 v61.11,37.4
CH_PD
  Top 0.254: 88.74,12.74 88.86,12.74 88.82,12.74 | 88.82,12.74 90.45,12.74 R7.1 | ESP-12.11 85.78,12.85 85.89,12.74 88.74,12.74 | 88.74,12.74 88.74,16.15 90.5,17.98 C21.1 | CH_PD.1 90.23,6.79 90.23,7.37 88.85,8.75 88.85,12.74 88.82,12.74
D0/RX
  Top 0.254: UART_RFM.2 109.13,24.46 109.36,24.46 | 109.36,24.46 109.62,24.46 111.1,24.46 112.43,25.79 112.43,49.54 110.88,51.09 GPIO_1.7 | TX.2 109.38,24.44 109.36,24.46
D1/TX
  Top 0.254: RX.1 104.29,20.62 104.29,26.01 104.41,26.12 104.41,26.45 UART_RFM.3 104.51,31.39 110.34,37.22 GPIO_1.9
ESPRX  (via drill 0.48, 0.5)
  Top 0.254: R17.2 66.92,12.51 66.92,10.45 R18.1 67.03,10.57 67.6,10.57 67.83,10.79 68.29,10.79 68.52,10.57 69.2,10.57 69.43,10.79 ESP-12.7 69.55,10.91 v71.26,10.91 | RX.2 101.77,19.72 93,10.95 v90.72,10.95
  Bottom 0.254: v90.72,10.95 71.3,10.95 v71.26,10.91
ESPTX  (via drill 0.48)
  Top 0.254: v79.72,23.37 79.72,17.54 71.15,8.97 69.55,8.97 ESP-12.8 | UART_ESP.2 81.55,26.45 81.55,27.83 82.8,29.08 89.4,29.08 94.66,23.83 100.5,23.83 103.04,21.28 103.04,19.61 103.82,18.82 104.97,18.82 106.81,20.65 TX.1
  Bottom 0.254: v79.72,23.37 81.43,25.08 81.43,26.34 UART_ESP.2
GND  (via drill 0.5, 3.8 pad 5.59)
  other vias: 16.68,67.2 98.67,67.22 16.68,9.19 98.67,9.19 47.77,47.48 47.9,22.02 52.91,61.96 54.91,66.96 56.91,61.96 71.7,70.41 67.34,70.41 67.62,73.16 67.12,61.13 64.23,61.07 65.69,59.43 68.47,58.63 73.66,72.31 75.66,53.31 75.7,54.61 76.23,55.9 102.91,58.17 94.4,58.56 94.45,57.09 103.05,56.68 101.95,37.95 75.07,38.94 40.27,57.98 40.27,43.98 40.27,32.48 40.14,18.48 41.97,6.16 67.64,23.46 89.3,26.74 67.36,36.64 54.13,49.35 63.23,22.41 62.93,19.69 41.38,7.33 41.26,4.89 75.68,70.33 71.28,21.84 55.27,51.98 52.45,29.23 53.04,22.4 58.45,11.12 63.74,11.44 38.62,59 37.39,56.94 42.07,41.71 38.47,41.69 38.27,16.85 38.3,20 42.08,33.98 38.5,34.01 86.01,61.82 71.21,36.65 67.81,43.32 67.34,71.91 67.34,68.91 56.91,63.46 56.91,64.96 52.91,63.46 52.91,64.96 52.91,66.46 56.91,66.46 67.62,74.66 69.12,74.66 69.12,73.16 46.36,68.52 46.36,67.52 47.39,68.02 62.92,30.13 60.63,30.15 72.71,36.65 86.79,59.09 91.33,61 74.43,22.07 96.6,46.98 86.71,30.46 78.84,13.19 74.65,14.08 51.83,10.34 48.49,8.36 80.49,33.13 73,33.89 70.84,29.7 56.86,41.4 58.13,34.07 52.79,36.34 72.25,47.38 78.08,40.87 80.36,36.43 47.79,16.01 88.33,17.8 106.42,31.55 111.38,29.73
  pour Bottom (isolate 0.305, rank 3): 13.45,76.2 13.45,64.87 36.57,64.87 36.57,11.7 13.45,11.7 13.45,0.25 102.35,0.25 102.35,12.95 113.9,12.95 113.9,63.5 102.35,63.5 102.35,76.2
  pour Top (isolate 0.254, rank 3, no thermals): 13.45,76.33 13.45,66.16 36.69,66.04 36.69,10.25 13.45,10.38 13.45,0.25 102.35,0.25 102.35,12.95 113.9,12.95 113.9,63.5 102.35,63.5 102.35,76.2
GPIO0
  Top 0.254: BOOT.2 63.6,26.45 63.83,26.45 65.09,25.2 69.65,25.2 72.4,22.45 72.4,18.23 71.15,16.97 69.55,16.97 ESP-12.4 67.52,16.89 R12.1
GPIO2  (via drill 0.48, 0.5)
  Top 0.254: v71.26,19.25 71.03,19.03 69.66,19.03 69.55,18.91 ESP-12.3 67.4,18.89 R6.1 | v69.77,28.22 69.77,36.23 67.31,38.69 MCP3208.10
  Bottom 0.254: v71.26,19.25 69.77,20.74 v69.77,28.22
GPIO12  (via drill 0.5)
  Top 0.254: v80.16,14.19 83.84,17.87 83.84,18.72 | 83.84,18.72 84.01,18.89 ESP-12.14 | R4.2 R8.1 73.21,38.36 v74.24,37.33 | 83.84,18.72 80.67,21.89 80.67,23.58 80.19,24.32 80.19,27.77 77.26,30.47 77.26,36.97 77.52,37.22 v77.58,37.22 | v81.64,12.33 75.97,6.66 65.78,6.66 63.09,9.36 60.94,9.36 56.64,5.07 MICRO_SD.PIN7
  Bottom 0.254: v74.24,37.33 77.47,37.33 v77.58,37.22 | v80.16,14.19 81.64,12.71 v81.64,12.33
GPIO12A
  Top 0.254: MCP3208.12 68.33,41.23 68.8,40.76 R4.1
GPIO13  (via drill 0.5)
  Top 0.254: MICRO_SD.PIN3 51.23,9.47 52.59,8.11 58.39,8.11 60.56,10.28 63.46,10.28 65.92,7.82 71.44,7.82 71.74,8.12 v81.34,17.72 | v81.84,23.22 82.24,23.22 83.61,21.86 84.72,21.86 ESP-12.15 84.51,20.89 v83.84,20.22 | v71.41,31.25 70.36,32.3 70.36,36.54 66.94,39.96 MCP3208.11
  Bottom 0.254: v81.84,23.22 80.74,23.22 80.06,22.54 79.38,22.54 77.65,24.27 77.65,27.89 74.29,31.25 v71.41,31.25 | v81.34,17.72 v83.84,20.22
GPIO14  (via drill 0.5)
  Top 0.254: MCP3208.13 66.35,41.88 73.59,41.88 74.04,41.44 74.04,38.71 75.65,37.1 75.65,29.34 75.21,28.91 75.21,23.81 76.34,22.82 v76.34,20.22 | ESP-12.13 84.5,16.89 v83.59,15.99 74.88,7.27 65.83,7.27 63.27,9.82 60.75,9.82 58.2,7.27 MICRO_SD.PIN5
  Bottom 0.254: v76.34,20.22 80.32,20.22 83.61,23.51 84.29,23.51 84.77,23.02 84.77,22.34 80.38,17.95 80.38,16.91 80.74,16.56 83.02,16.56 v83.59,15.99
GPIO15  (via drill 0.5)
  Top 0.254: MICRO_SD.PIN2 48.19,10.57 54.34,16.72 v60.1,16.72 | v60.58,19.24 62.21,20.87 63.8,20.87 64.72,21.79 66.56,21.79 66.9,21.45 R3.1 67.33,20.89 ESP-12.2
  Bottom 0.254: v60.1,16.72 60.1,18.76 v60.58,19.24
GPIO16  (via drill 0.48)
  Top 0.254: v87.49,14.91 85.78,14.91 ESP-12.12
  Bottom 0.254: SJ7.1 85.76,14.91 v87.49,14.91 89.43,14.91 94.01,19.49 IO16.1
LOAD-NEG-A
  Top 0.254: R16.1 30.53,52.97 arc-90 X3.2
  pour Top (no thermals): 0.34,62.72 33.34,62.72 33.34,51.72 0.34,51.72
  pour Bottom (isolate 0.813, no thermals): 33.34,62.72 0.34,62.72 0.34,51.72 33.34,51.72
LOAD-NEG-A_T
  Top 0.254: D2.C 40.24,52.97
  Top 0.406: R16.2 40.24,52.97 42.61,52.97 | 42.61,52.97 43.34,52.97 | 43.34,52.97 45.36,52.97 SHUNTMON-A.8 | C1.1 42.61,52.97 | C23.2 43.34,53.87 43.34,52.97
LOAD-NEG-B
  Top 0.254: R23.1 30.78,27.47 arc-90 X4.2
  pour Top (no thermals): 0.34,37.22 33.34,37.22 33.34,26.22 0.34,26.22
  pour Bottom (isolate 0.813, no thermals): 33.34,37.22 0.34,37.22 0.34,26.22 33.34,26.22
LOAD-NEG-B_T
  Top 0.305: 38.23,27.42 38.23,27.47 | 38.23,27.48 38.23,27.47 | 38.23,27.47 38.34,27.47
  Top 0.406: R23.2 38.34,27.47 42.61,27.47 | 42.61,27.47 43.09,27.47 | 43.09,27.47 45.36,27.47 SHUNTMON-B.8 | D4.C 38.23,27.42 | C8.1 42.61,27.47 | C24.2 43.09,27.47
LX  (2 unrouted)
  Top 0.406: D1.C 65.74,64.81 65.84,64.72
  Top 0.508: REG0.8 64.85,67.72 64.85,66.95 | REG0.8 65.21,67.36 65.4,67.36 64.99,66.95 64.85,66.95 | 64.85,66.95 64.37,67.43 64.33,67.43 | 64.26,67.43 64.33,67.43 | 64.33,67.43 REG0.8 | 64.26,67.81 64.26,66.07 64.63,65.7 | 65.29,65.04 64.63,65.7 | 64.63,65.7 64.63,66.4 65.48,67.25 | 65.48,67.25 65.48,67.82 | 65.48,67.25 65.48,66.06 66.15,65.4
  Top 0.61: C4.2 72.34,64.86 72.34,64.72
  Top 1.016: L1.1 79.68,69.06 | 64.85,66.95 65.54,65.23
  Top 1.27: 79.68,69.06 75.34,64.72 72.34,64.72 65.84,64.72
MCP_VCC
  Top 0.254: 69.55,47.71 C19.1 | MCP3208.16 65.77,46.23 65.9,46.36
  Top 0.305: 69.55,47.71 68.57,47.71 67.89,47.71 67.3,47.12 67.3,46.36 | SJ1.1 69.81,47.45 | MCP3208.15 67.64,45.04 67.93,45.34 67.93,46.1 67.68,46.36 67.3,46.36 | 67.3,46.36 65.9,46.36
  Top 0.406: 69.81,47.45 69.55,47.71
N$1  (via drill 0.5)
  Top 0.254: 73.36,73.83 73.36,74.58 v73.37,74.86
  Top 0.406: R21.2 72.25,72.63 71.26,71.65 REG0.4
  Top 0.508: R21.2 72.3,73.83 73.36,73.83 R20.1
N$5
  Top 0.254: R26.1 87.25,35.81 85.83,35.81 LED1.A
N$10
  Top 0.254: PCF8523.8 55.03,18.34 55.03,20.75 54.74,21.04 54.78,21.03 C7T.1 54.8,21.11 54.65,21.52 54.65,23.32 54.26,23.71 R9.1
N$24
  Top 0.254: R9.2 55.2,25.41 55.55,25.06 SJ2.2
N$30  (via drill 0.5)
  Top 0.254: v88.71,19.71 90.87,19.71 C21.2
  Bottom 0.254: UART_ESP.1 88.71,21.77 v88.71,19.71
N$36
  Top 0.254: R17.1 65.32,12.62 66.12,13.42 67.6,13.42 67.83,13.2 67.83,12.39 68.29,11.94 70.69,11.94 78,19.25 78,24.17 78.92,25.08 78.92,26.34 UART_ESP.3
N$44
  Top 0.254: PCF8523.2 56.4,12.85 56.4,9.47 56.53,9.34 Y1.P$4
N$45
  Top 0.254: Y1.P$1 arc90 55.1,10.5 PCF8523.1
N$301
  Top 0.254: C2.2 109.92,26.77 UART_RFM.1
PRE_6.5V
  Top 0.508: R20.2 85.34,73.83 L1.2
  Top 1.016: 83.8,62.76 83.55,62.51 C48.1 83.55,57.31 SJ4.1 | L1.2 91.34,67.83 91.34,64.72 93.03,63.03 TP1.TP
  Top 1.27: L1.2 83.8,62.76 81.58,60.54 C3.1
REF_A_INPUT
  Top 0.254: SHUNTMON-A.7 46.11,53.2 arc-90 46.01,53.31 46.01,54.19 arc-90 46.45,54.64 46.98,54.64 | 46.57,53.2 SHUNTMON-A.6 | 46.57,53.43 46.57,53.32 SHUNTMON-A.6 | 50.41,56.4 REF_SEL_A.2 50.51,56.16 arc-90 48.99,54.64 46.98,54.64 | SHUNTMON-A.6 46.66,54.32 arc-90 46.98,54.64
REF_B_INPUT
  Top 0.254: SHUNTMON-B.7 46.11,27.6 46.57,27.6 SHUNTMON-B.6 46.69,27.71 46.69,28.95 50.18,32.44 50.18,32.6 50.19,32.6 REF_SEL_B.2
RST  (via drill 0.5)
  Top 0.254: v83.17,12.06 83.17,10.29 84.57,8.89 ESP-12.9 | v89.7,13.97 90.55,14.83 R19.1
  Bottom 0.254: v83.17,12.06 83.68,12.57 SJ7.2 88.3,12.57 v89.7,13.97
SCL  (via drill 0.5)
  Top 0.254: R27.2 57.6,20.64 v57.6,19.37 PCF8523.6 | ESP-12.6 69.89,13.3 70.79,13.3 71.58,14.09 v71.58,15.03 | v60.73,11.49 60.73,13.71 v58.7,15.74
  Bottom 0.254: v71.58,15.03 62.88,6.33 P1.2 61.7,6.33 60.78,7.24 60.77,11.53 v60.73,11.49 | v58.7,15.74 57.6,16.84 v57.6,19.37
SDA  (via drill 0.5)
  Top 0.254: 64.34,14.72 60.8,18.26 PCF8523.5 58.9,19.58 R28.2 | 64.34,14.72 69.31,14.72 ESP-12.5 | 64.34,14.72 62.42,12.8 v62.42,11.5
  Bottom 0.254: v62.42,11.5 62.42,8.69 P1.1
SOURCE-POS-A
  Top 0.254: R22.1 30.53,48.97 arc90 X3.1
  Bottom 1.016: PWR.3 35.28,63.17 32.84,60.72 32.84,49.5 30.5,47.16 X3.1
  pour Top (no thermals): 0.34,50.22 33.34,50.22 33.34,39.22 0.34,39.22
  pour Bottom (isolate 0.813, no thermals): 33.34,50.22 0.34,50.22 0.34,39.22 33.34,39.22
SOURCE-POS-A_T
  Top 0.254: 45.43,48.74 SHUNTMON-A.1 | 46,48.74 SHUNTMON-A.2
  Top 0.305: 45.36,48.97 SHUNTMON-A.1 | D3.C 40.24,48.97
  Top 0.406: 45.66,48.51 45.66,47.48 45.43,47.26 45.43,45.88 R14.2 | 45.43,48.74 45.66,48.51 | 46,48.74 45.77,48.51 45.66,48.51 | R22.2 40.24,48.97 42.61,48.97 | 42.61,48.97 43.34,48.97 | 43.34,48.97 45.36,48.97 | C1.2 42.61,48.97 | C25.1 43.34,48.07 43.34,48.97
SOURCE-POS-B
  Top 0.254: R24.1 30.78,23.47 arc90 X4.1
  Bottom 1.016: PWR.1 42.49,61.88 41.58,60.97 36.09,60.97 34.84,59.71 34.84,26.26 30.24,21.66 X4.1
  pour Top (no thermals): 0.34,24.72 33.34,24.72 33.34,13.72 0.34,13.72
  pour Bottom (isolate 0.813, no thermals): 33.34,24.72 0.34,24.72 0.34,13.72 33.34,13.72
SOURCE-POS-B_T
  Top 0.254: 45.66,20.27 R1.2 | 45.43,23.25 SHUNTMON-B.1 | SHUNTMON-B.2 46,23.25 45.77,23.03 45.66,23.03
  Top 0.305: D5.C 40.24,23.47
  Top 0.406: 45.66,20.27 45.66,23.03 45.43,23.25 | R24.2 40.24,23.47 42.61,23.47 | 43.09,23.47 45.36,23.47 SHUNTMON-B.1 | C8.2 42.61,23.47 | 42.61,23.47 43.09,23.47 | 43.09,23.47 C6.1
UNI_REF  (via drill 0.5)
  Top 0.254: R13.1 78.22,43.36 73.49,43.36 73.14,43.71 73.14,47.94 72.51,48.57 66.44,48.57 | 66.44,48.57 62.97,45.1 62.97,41.95 v60.99,39.96 MCP3208.6 59.39,39.96 56.36,36.93 56.36,36.34 | 56.36,36.34 | 66.44,48.57 66.44,47.84 v66.32,47.73 | v61.34,50.35 v61.34,50.36 53.79,57.91 48.25,57.91 47.97,57.64 REF_SEL_A.1 | 56.36,36.34 56.36,36.16 C9.1 56.32,36.03 54.47,34.19 v54.47,33.93
  Top 0.406: R5.2 83.05,40.39 R13.1
  Bottom 0.254: REF_SEL_B.1 48,33.59 48.84,34.43 53.98,34.43 v54.47,33.93 | v66.32,47.73 63.69,50.35 v61.34,50.35
V_IN_POSTFUSE
  Top 0.61: C16.1 64.59,71.79 REG0.5 63.67,71.65 arc90 62.52,70.5 arc90 63.93,69.09 64.63,69.09 64.65,69.11 REG0.7
  Top 1.016: F1.P$4 arc-90 40.62,71.64 D7.C
  Top 1.27: F1.P$3 54.83,72.87 C10.1 59.79,73.22 60.41,72.61 62.52,70.5
  Bottom 1.27: F1.P$4 F1.P$3
V_IN_PREFUSE
  Bottom 1.016: F1.P$1 F1.P$2 30.25,72.87 arc-90 PWR.2
VBAT  (via drill 0.5)
  Top 0.254: v57.6,14.77 57.6,14.76 PCF8523.3
  Bottom 0.254: CR1220.P+ 50.39,13.81 51.35,14.77 v57.6,14.77 57.52,14.69 3.3V_BAT.2
VCC_ESP  (via drill 0.48, 0.5)
  Top 0.254: R7.2 92.29,12.51 92.29,14.79 R19.2 93.28,15.92 93.28,16.4 v93.28,23.6 v93.29,23.6 | R12.2 65.2,16.4 65.2,18.34 R6.2 65.09,18.34 v63.95,18.34 | 89.21,23.6 C22.2 89.32,23.6 | 85.78,22.91 ESP-12.16 85.66,22.91 84.18,22.91 v83.95,22.68
  Top 0.406: 89.21,23.6 87.95,23.6 87.26,22.91 85.78,22.91 | v93.29,23.6 93.17,23.6 89.32,23.6 | SJ3.1 90.36,30.54 93.42,27.48 93.42,26.8 v93.34,26.72
  Bottom 0.254: v63.95,18.34 79.6,18.34 v83.95,22.68
  Bottom 0.406: v93.34,26.72 93.34,23.47 v93.29,23.6
VD
  Top 0.508: C5.1 73.32,69.11 REG0.2
VSENSE_A
  Top 0.254: 45.43,44.17 R14.1 45.39,42.22 R15.2 46.2,42.19 46.99,41.4 50.17,41.4 50.2,41.43 LM258.3
VSENSE_A_BUFF  (via drill 0.5)
  Top 0.254: LM258.2 LM258.1 54.2,45.04 MCP3208.2 v61.07,45.05
VSENSE_B  (via drill 0.48)
  Top 0.254: R1.1 45.43,18.57 46.69,18.57 47.03,18.91 47.72,18.91 47.83,19.03 R2.2 47.82,19.17 v47.82,20.78 | v45.58,30.07 45.58,35.04 LM258.5
  Bottom 0.254: v47.82,20.78 47.68,20.78 45.54,22.91 45.54,30.03 v45.58,30.07
VSENSE_B_BUFF  (via drill 0.5)
  Top 0.254: LM258.6 LM258.7 51.54,38.46 51.54,39.63 52.23,40.32 53.95,40.32 56.14,42.5 MCP3208.4 arc-90 60.38,42.54 v61.1,42.54
  Bottom 0.254: v61.1,42.54 arc90 61.22,42.42

### Text on the board
bPlace: emonDC | wireless energy monitoring node | Technology that helps us live within ecological limits | Designed in North Wales UK / by Daniel Bates | OpenEnergyMonitor.org | Designed in | North Wales | Made in UK | Lead free PCB - RoHS components | Open-Hardware
tNames: 100uF | 80V | ***WARNING*** / FLOATING / VOLTAGES | 150uH | - | A | B | LOAD | 16V | 470uF | A | LMP8481 | SOURCE | + | - | LOAD | CH7 | B | LMP8481 | SOURCE | RESET | + | EN | LCD | I2C | 1V
tSilk: RFM69Pi | UNI | REF | UNI | REF | GND | 5V | Tx | Rx | RST | GND | TX / RX / RFM | emonDC / _duo_ | Wireless Energy / Monitoring Node | v2.4 Jul 2018 by DB
_tsilk: Designed in | North Wales | Made in UK
_bsilk: SMT V0.6 rev3 | emonTx | wireless energy monitoring node | SMT V0.6 rev3 | emonTx | SMT V0.6 rev3 | emonTx | Technology that helps us live within ecological limits | wireless energy monitoring node | wireless energy monitoring node | Designed in North Wales UK by Glyn Hudson & Trystan Lea | Technology that helps us live within ecological limits | Technology that helps us live within ecological limits | Designed in North Wales UK by Glyn Hudson & Trystan Lea | 165mm ant | 433Mhz | Designed in North Wales UK by Glyn Hudson & Trystan Lea | 165mm ant | 165mm ant | 433Mhz | 433Mhz | 868Mhz | 82mm ant | 82mm ant | 82mm ant | 868Mhz | 868Mhz | 78mm ant | 915Mhz | 78mm ant | 915Mhz | 78mm ant | 915Mhz | 165mm ant | 433Mhz | 82mm ant | 868Mhz | 78mm ant | 915Mhz